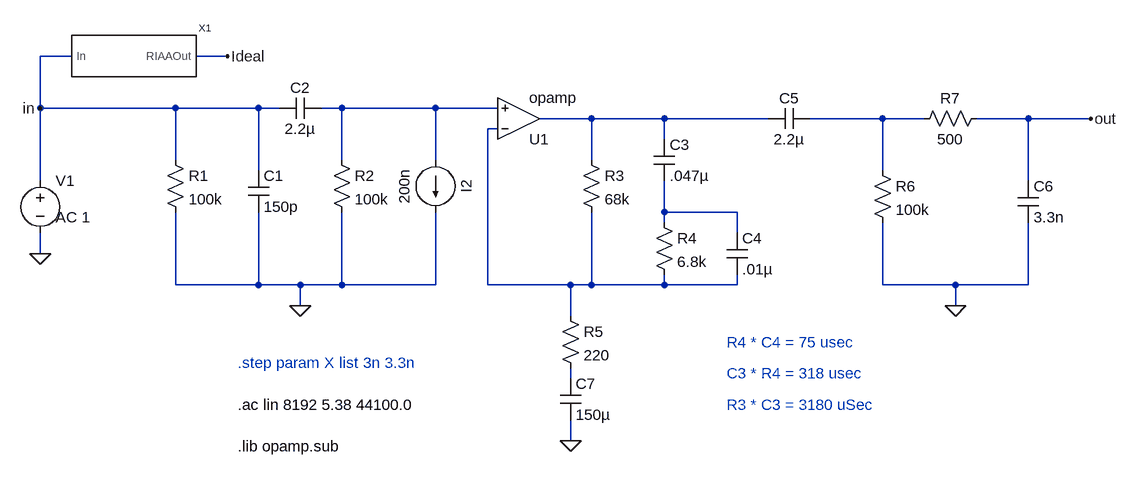
[diagram p0: schematic Signal path.asc]
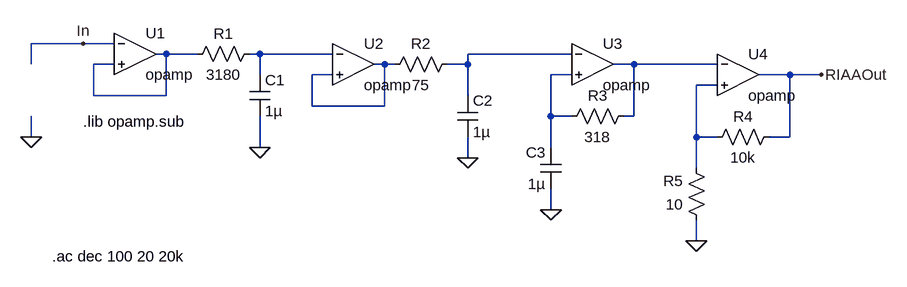
[diagram p1: sub-circuit riaaideal.asc]
Signal path.asc, the LTspice schematic file:
Version 4
SHEET 1 880 724
WIRE -848 -32 -896 -32
WIRE -608 -32 -656 -32
WIRE -896 48 -896 -32
WIRE -688 48 -896 48
WIRE -560 48 -688 48
WIRE -528 48 -560 48
WIRE -432 48 -464 48
WIRE -288 48 -432 48
WIRE -192 48 -288 48
WIRE -48 64 -128 64
WIRE 64 64 -48 64
WIRE 224 64 64 64
WIRE 400 64 288 64
WIRE 464 64 400 64
WIRE 624 64 544 64
WIRE 720 64 624 64
WIRE -192 80 -208 80
WIRE 64 96 64 64
WIRE -688 128 -688 48
WIRE -432 128 -432 48
WIRE -288 128 -288 48
WIRE -48 128 -48 64
WIRE -560 144 -560 48
WIRE 400 144 400 64
WIRE -896 160 -896 48
WIRE 624 160 624 64
WIRE 64 208 64 160
WIRE 176 208 64 208
WIRE 64 224 64 208
WIRE 176 240 176 208
WIRE -896 272 -896 240
WIRE -688 320 -688 208
WIRE -560 320 -560 208
WIRE -560 320 -688 320
WIRE -496 320 -560 320
WIRE -432 320 -432 208
WIRE -432 320 -496 320
WIRE -288 320 -288 208
WIRE -288 320 -432 320
WIRE -208 320 -208 80
WIRE -80 320 -208 320
WIRE -48 320 -48 208
WIRE -48 320 -80 320
WIRE 64 320 64 304
WIRE 64 320 -48 320
WIRE 176 320 176 304
WIRE 176 320 64 320
WIRE 400 320 400 224
WIRE 512 320 400 320
WIRE 624 320 624 224
WIRE 624 320 512 320
WIRE -496 352 -496 320
WIRE 512 352 512 320
WIRE -80 368 -80 320
WIRE -80 464 -80 448
WIRE -80 560 -80 528
FLAG -896 272 0
FLAG -80 560 0
FLAG 512 352 0
FLAG 720 64 out
FLAG -496 352 0
FLAG -896 48 in
FLAG -608 -32 Ideal
SYMBOL voltage -896 144 R0
WINDOW 3 24 44 Invisible 2
WINDOW 123 24 72 Left 2
WINDOW 39 0 0 Left 2
SYMATTR Value SINE(0.3m 0 1k)
SYMATTR Value2 AC 1
SYMATTR InstName V1
SYMBOL cap -576 208 M180
WINDOW 0 24 56 Left 2
WINDOW 3 24 8 Left 2
SYMATTR InstName C1
SYMATTR Value 150p
SYMBOL res -448 112 R0
SYMATTR InstName R2
SYMATTR Value 100k
SYMBOL res -64 112 R0
SYMATTR InstName R3
SYMATTR Value 68k
SYMBOL res 48 208 R0
SYMATTR InstName R4
SYMATTR Value 6.8k
SYMBOL cap 48 96 R0
SYMATTR InstName C3
SYMATTR Value .047µ
SYMBOL cap 160 240 R0
SYMATTR InstName C4
SYMATTR Value .01µ
SYMBOL res -96 352 R0
SYMATTR InstName R5
SYMATTR Value 220
SYMBOL res 384 128 R0
SYMATTR InstName R6
SYMATTR Value 100k
SYMBOL res 560 48 R90
WINDOW 0 0 56 VBottom 2
WINDOW 3 32 56 VTop 2
SYMATTR InstName R7
SYMATTR Value 500
SYMBOL cap 608 160 R0
SYMATTR InstName C6
SYMATTR Value 3.3n
SYMBOL Opamps\\opamp -160 128 M180
SYMATTR InstName U1
SYMBOL res -704 112 R0
SYMATTR InstName R1
SYMATTR Value 100k
SYMBOL cap -464 32 R90
WINDOW 0 0 32 VBottom 2
WINDOW 3 32 32 VTop 2
SYMATTR InstName C2
SYMATTR Value 2.2µ
SYMBOL cap 288 48 R90
WINDOW 0 0 32 VBottom 2
WINDOW 3 32 32 VTop 2
SYMATTR InstName C5
SYMATTR Value 2.2µ
SYMBOL current -288 128 R0
WINDOW 0 32 40 VTop 2
WINDOW 3 -32 40 VBottom 2
WINDOW 123 0 0 Left 2
WINDOW 39 0 0 Left 2
SYMATTR InstName I2
SYMATTR Value 200n
SYMBOL cap -96 464 R0
SYMATTR InstName C7
SYMATTR Value 150µ
SYMBOL RIAAIdeal -784 -32 R0
SYMATTR InstName X1
TEXT -592 568 Left 2 !.lib opamp.sub
TEXT -592 440 Left 2 ;.step param X list 3n 3.3n
TEXT -592 504 Left 2 !.ac lin 8192 5.38 44100.0
TEXT 160 408 Left 2 ;R4 * C4 = 75 usec
TEXT 160 456 Left 2 ;C3 * R4 = 318 usec
TEXT 160 504 Left 2 ;R3 * C3 = 3180 uSec

riaaideal.asc, the sub-circuit schematic file:
Version 4
SHEET 1 1236 680
WIRE -48 112 -128 112
WIRE 0 112 -48 112
WIRE 80 128 64 128
WIRE 128 128 80 128
WIRE 224 128 208 128
WIRE 336 128 224 128
WIRE 704 128 544 128
WIRE -128 144 -128 112
WIRE 0 144 -32 144
WIRE 416 144 400 144
WIRE 432 144 416 144
WIRE 544 144 544 128
WIRE 544 144 512 144
WIRE 800 144 768 144
WIRE 928 144 800 144
WIRE 224 160 224 128
WIRE 336 160 304 160
WIRE 704 160 672 160
WIRE 1040 160 992 160
WIRE 1088 160 1040 160
WIRE 928 176 896 176
WIRE -32 192 -32 144
WIRE 80 192 80 128
WIRE 80 192 -32 192
WIRE 544 192 544 144
WIRE 304 208 304 160
WIRE 416 208 416 144
WIRE 416 208 304 208
WIRE 672 224 672 160
WIRE 704 224 672 224
WIRE 800 224 800 144
WIRE 800 224 784 224
WIRE -128 256 -128 224
WIRE 896 256 896 176
WIRE 928 256 896 256
WIRE 1040 256 1040 160
WIRE 1040 256 1008 256
WIRE 224 272 224 224
WIRE 672 272 672 224
WIRE 544 288 544 256
WIRE 896 304 896 256
WIRE 672 368 672 336
WIRE 896 416 896 384
FLAG 896 416 0
FLAG 224 272 0
FLAG 544 288 0
FLAG 672 368 0
FLAG 1088 160 RIAAOut
FLAG -48 112 In
FLAG -128 256 0
SYMBOL Opamps\\opamp 32 64 R0
SYMATTR InstName U1
SYMBOL Opamps\\opamp 368 80 R0
SYMATTR InstName U2
SYMATTR SpiceLine2 GBW=1000Meg
SYMBOL Opamps\\opamp 736 80 R0
SYMATTR InstName U3
SYMATTR SpiceLine2 GBW=1000Meg
SYMBOL res 224 112 R90
WINDOW 0 0 56 VBottom 2
WINDOW 3 32 56 VTop 2
SYMATTR InstName R1
SYMATTR Value 3180
SYMBOL cap 208 160 R0
SYMATTR InstName C1
SYMATTR Value 1µ
SYMBOL Opamps\\opamp 960 96 R0
SYMATTR InstName U4
SYMATTR SpiceLine2 GBW=1000Meg
SYMATTR SpiceLine Aol=1000K
SYMBOL res 528 128 R90
WINDOW 0 0 56 VBottom 2
WINDOW 3 32 56 VTop 2
SYMATTR InstName R2
SYMATTR Value 75
SYMBOL res 688 240 R270
WINDOW 0 32 56 VTop 2
WINDOW 3 0 56 VBottom 2
SYMATTR InstName R3
SYMATTR Value 318
SYMBOL res 1024 240 R90
WINDOW 0 0 56 VBottom 2
WINDOW 3 32 56 VTop 2
SYMATTR InstName R4
SYMATTR Value 10k
SYMBOL res 912 400 R180
WINDOW 0 36 76 Left 2
WINDOW 3 36 40 Left 2
SYMATTR InstName R5
SYMATTR Value 10
SYMBOL cap 528 192 R0
SYMATTR InstName C2
SYMATTR Value 1µ
SYMBOL cap 688 336 R180
WINDOW 0 24 56 Left 2
WINDOW 3 24 8 Left 2
SYMATTR InstName C3
SYMATTR Value 1µ
TEXT -48 232 Left 2 !.lib opamp.sub
TEXT -96 440 Left 2 !.ac dec 100 20 20k

The netlist it stands for:
* Signal path.asc
V1 in 0 SINE(0.3m 0 1k) AC 1
C1 0 in 150p
R2 N001 0 100k
R3 N002 N004 68k
R4 N005 N004 6.8k
C3 N002 N005 .047µ
C4 N005 N004 .01µ
R5 N004 N006 220
R6 N003 0 100k
R7 out N003 500
C6 out 0 3.3n
XU1 N004 N001 N002 opamp Aol=100K GBW=10Meg  ; pins invin noninvin out
R1 in 0 100k
C2 N001 in 2.2µ
C5 N003 N002 2.2µ
I2 N001 0 200n
C7 N006 0 150µ
XX1 Ideal in riaaideal

* block symbol definitions
.subckt riaaideal RIAAOut In
XU1 In N001 N001 opamp Aol=100K GBW=10Meg  ; pins invin noninvin out
XU2 N002 N004 N004 opamp Aol=100K GBW=1000Meg  ; pins invin noninvin out
XU3 N003 N006 N005 opamp Aol=100K GBW=1000Meg  ; pins invin noninvin out
R1 N002 N001 3180
C1 N002 0 1µ
XU4 N005 N007 RIAAOut opamp Aol=1000K GBW=1000Meg  ; pins invin noninvin out
R2 N003 N004 75
R3 N006 N005 318
R4 RIAAOut N007 10k
R5 0 N007 10
C2 N003 0 1µ
C3 0 N006 1µ
.lib opamp.sub
.ac dec 100 20 20k
.ends riaaideal

.lib opamp.sub
* .step param X list 3n 3.3n
.ac lin 8192 5.38 44100.0
* R4 * C4 = 75 usec
* C3 * R4 = 318 usec
* R3 * C3 = 3180 uSec
.backanno
.end